# EAGLE schematic BOBBYPIN (EAGLE 6.6.0)
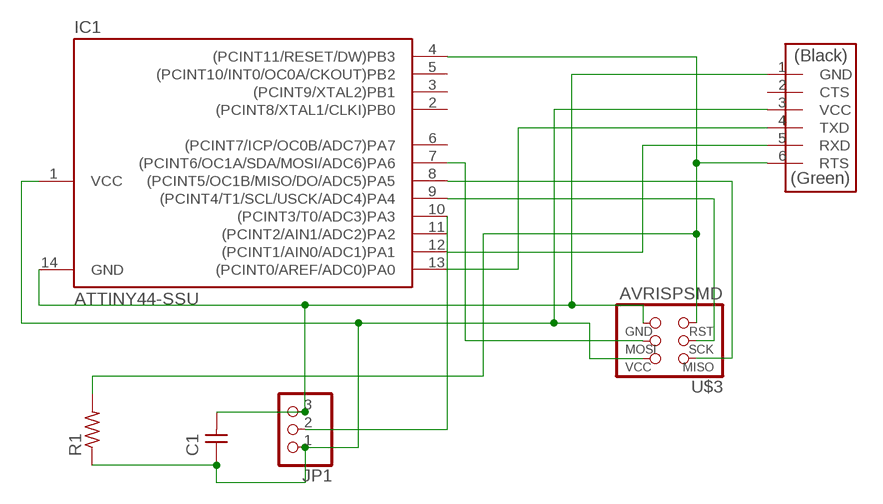
[diagram p0: schematic, sheet 1]

## Parts
C1  CAP-UNPOLARIZEDFAB  [C1206FAB]
IC1  ATTINY44-SSU  [SOIC14]
JP1  PINHD-1X3/90  [1X03/90]
R1  RES-US1206FAB  [R1206FAB]
U$2  FTDI-SMD-HEADER  [1X06SMD]
U$3  AVRISPSMD  [2X03SMD]

## Nets
N$1: IC1.8((PCINT5/OC1B/MISO/DO/ADC5)PA5) U$3.1(MISO)
N$2: IC1.7((PCINT6/OC1A/SDA/MOSI/ADC6)PA6) U$3.4(MOSI)
N$3: IC1.4((PCINT11/RESET/DW)PB3) R1.2 U$2.6(RTS) U$3.5(RST)
N$4: IC1.9((PCINT4/T1/SCL/USCK/ADC4)PA4) U$3.3(SCK)
N$5: C1.2 IC1.14(GND) JP1.3 U$2.1(GND) U$3.6(GND)
N$6: C1.1 IC1.1(VCC) JP1.1 R1.1 U$2.3(VCC) U$3.2(VCC)
N$7: IC1.13((PCINT0/AREF/ADC0)PA0) U$2.4(TXD)
N$8: IC1.12((PCINT1/AIN0/ADC1)PA1) U$2.5(RXD)
N$9: IC1.10((PCINT3/T0/ADC3)PA3) JP1.2
Unconnected: IC1.2((PCINT8/XTAL1/CLKI)PB0) IC1.3((PCINT9/XTAL2)PB1) IC1.5((PCINT10/INT0/OC0A/CKOUT)PB2) IC1.6((PCINT7/ICP/OC0B/ADC7)PA7) IC1.11((PCINT2/AIN1/ADC2)PA2) U$2.2(CTS)

## Library data of the parts
C1 = fab:CAP-UNPOLARIZED
IC1 = fab:ATTINY44
JP1 = pinhead:PINHD-1X3: PIN HEADER
R1 = fab:RES-US: Resistor (US Symbol) Variants with postfix FAB are widened to allow the routing of internal traces
U$2 = fab:FTDI-SMD-HEADER
U$3 = fab:AVRISP